# Altium schematic sheet Signal_Protection.SchDoc
size A4
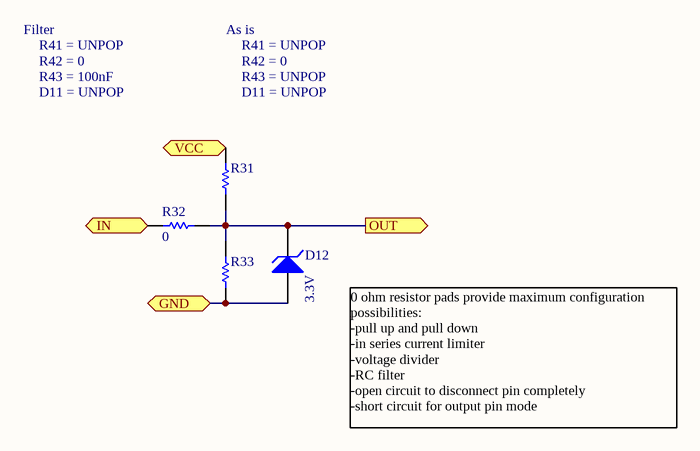
[diagram p0: Signal_Protection.SchDoc]

## Parts
D12  Voltage - Reverse Standoff (Typ): 3.3V  [DS-SOD523]  (hidden comment: DS - TVS ESD5Z3.3T1G)
R31  RS - RESISTOR  [RS-0603]  (value not drawn)
R32  value 0  [RS-0603]  (hidden comment: RS - RESISTOR)
R33  RS - RESISTOR  [RS-0603]  (value not drawn)

## Ports
GND, IN (in), OUT (out), VCC

## Nets
GND: D12.A R33.1 ; port GND
IN: R32.2 ; port IN
OUT: D12.K R31.2 R32.1 R33.2 ; port OUT
VCC: R31.1 ; port VCC

## Notes on the sheet
- Filter
- R41 = UNPOP
- R42 = 0
- R43 = 100nF
- As is
- R43 = UNPOP
- D11 = UNPOP
- 0 ohm resistor pads provide maximum configuration possibilities:
  -pull up and pull down
  -in series current limiter
  -voltage divider
  -RC filter
  -open circuit to disconnect pin completely
  -short circuit for output pin mode

## Library data of the parts
D12 = DS - TVS ESD5Z3.3T1G: TVS 3.3V; Manufacturer: ON Semiconductor; FORWARS VOLTAGE: *; (FIELD A): *; (FIELD B): *; Supplier 1: Digi-Key; Supplier Part Number 1: ESD5Z3.3T1GOSCT-ND
R31-R33 = RS - RESISTOR: TOLERANCE: RES TOL; POWER: RES POWER; Supplier Part Number 1: *; Supplier 1: *; (FIELD A): *; (FLIED C): *; (FIELD B): *; Manufacturer: *